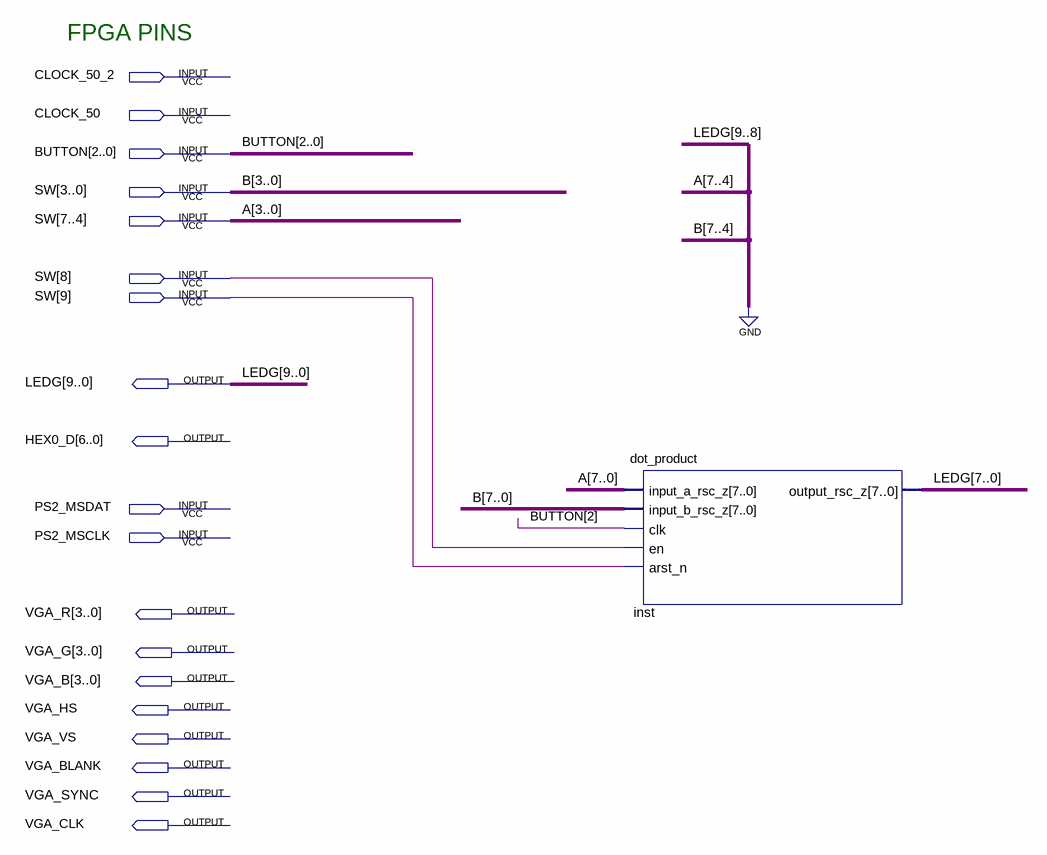
[diagram p0: schematic sheet]
// Quartus schematic ise_proj.bdf as structural Verilog: 1 symbols, 19 pins
module ise_proj (
  input  CLOCK_50_2,
  input  CLOCK_50,
  input  [2:0] BUTTON,
  input  [9:0] SW,
  input  PS2_MSDAT,
  input  PS2_MSCLK,
  output [9:0] LEDG,
  output [6:0] HEX0_D,
  output [3:0] VGA_R,
  output [3:0] VGA_G,
  output [3:0] VGA_B,
  output VGA_HS,
  output VGA_VS,
  output VGA_BLANK,
  output VGA_SYNC,
  output VGA_CLK
);

  wire [7:4] A;

  dot_product inst (
    .input_a_rsc_z({A, SW[7:4]}), .input_b_rsc_z({4'b0000, SW[3:0]}), .clk(BUTTON[2]), .en(SW[8]),
    .arst_n(SW[9]), .output_rsc_z(LEDG[7:0]));

  // Other names for the same wires on the sheet: A[3:0] = SW[7:4]; B[3:0] = SW[3:0]

  // Notes on the sheet:
  //   FPGA PINS
endmodule
